# Altium project Atomizer_medical_V1_4.PrjPcb
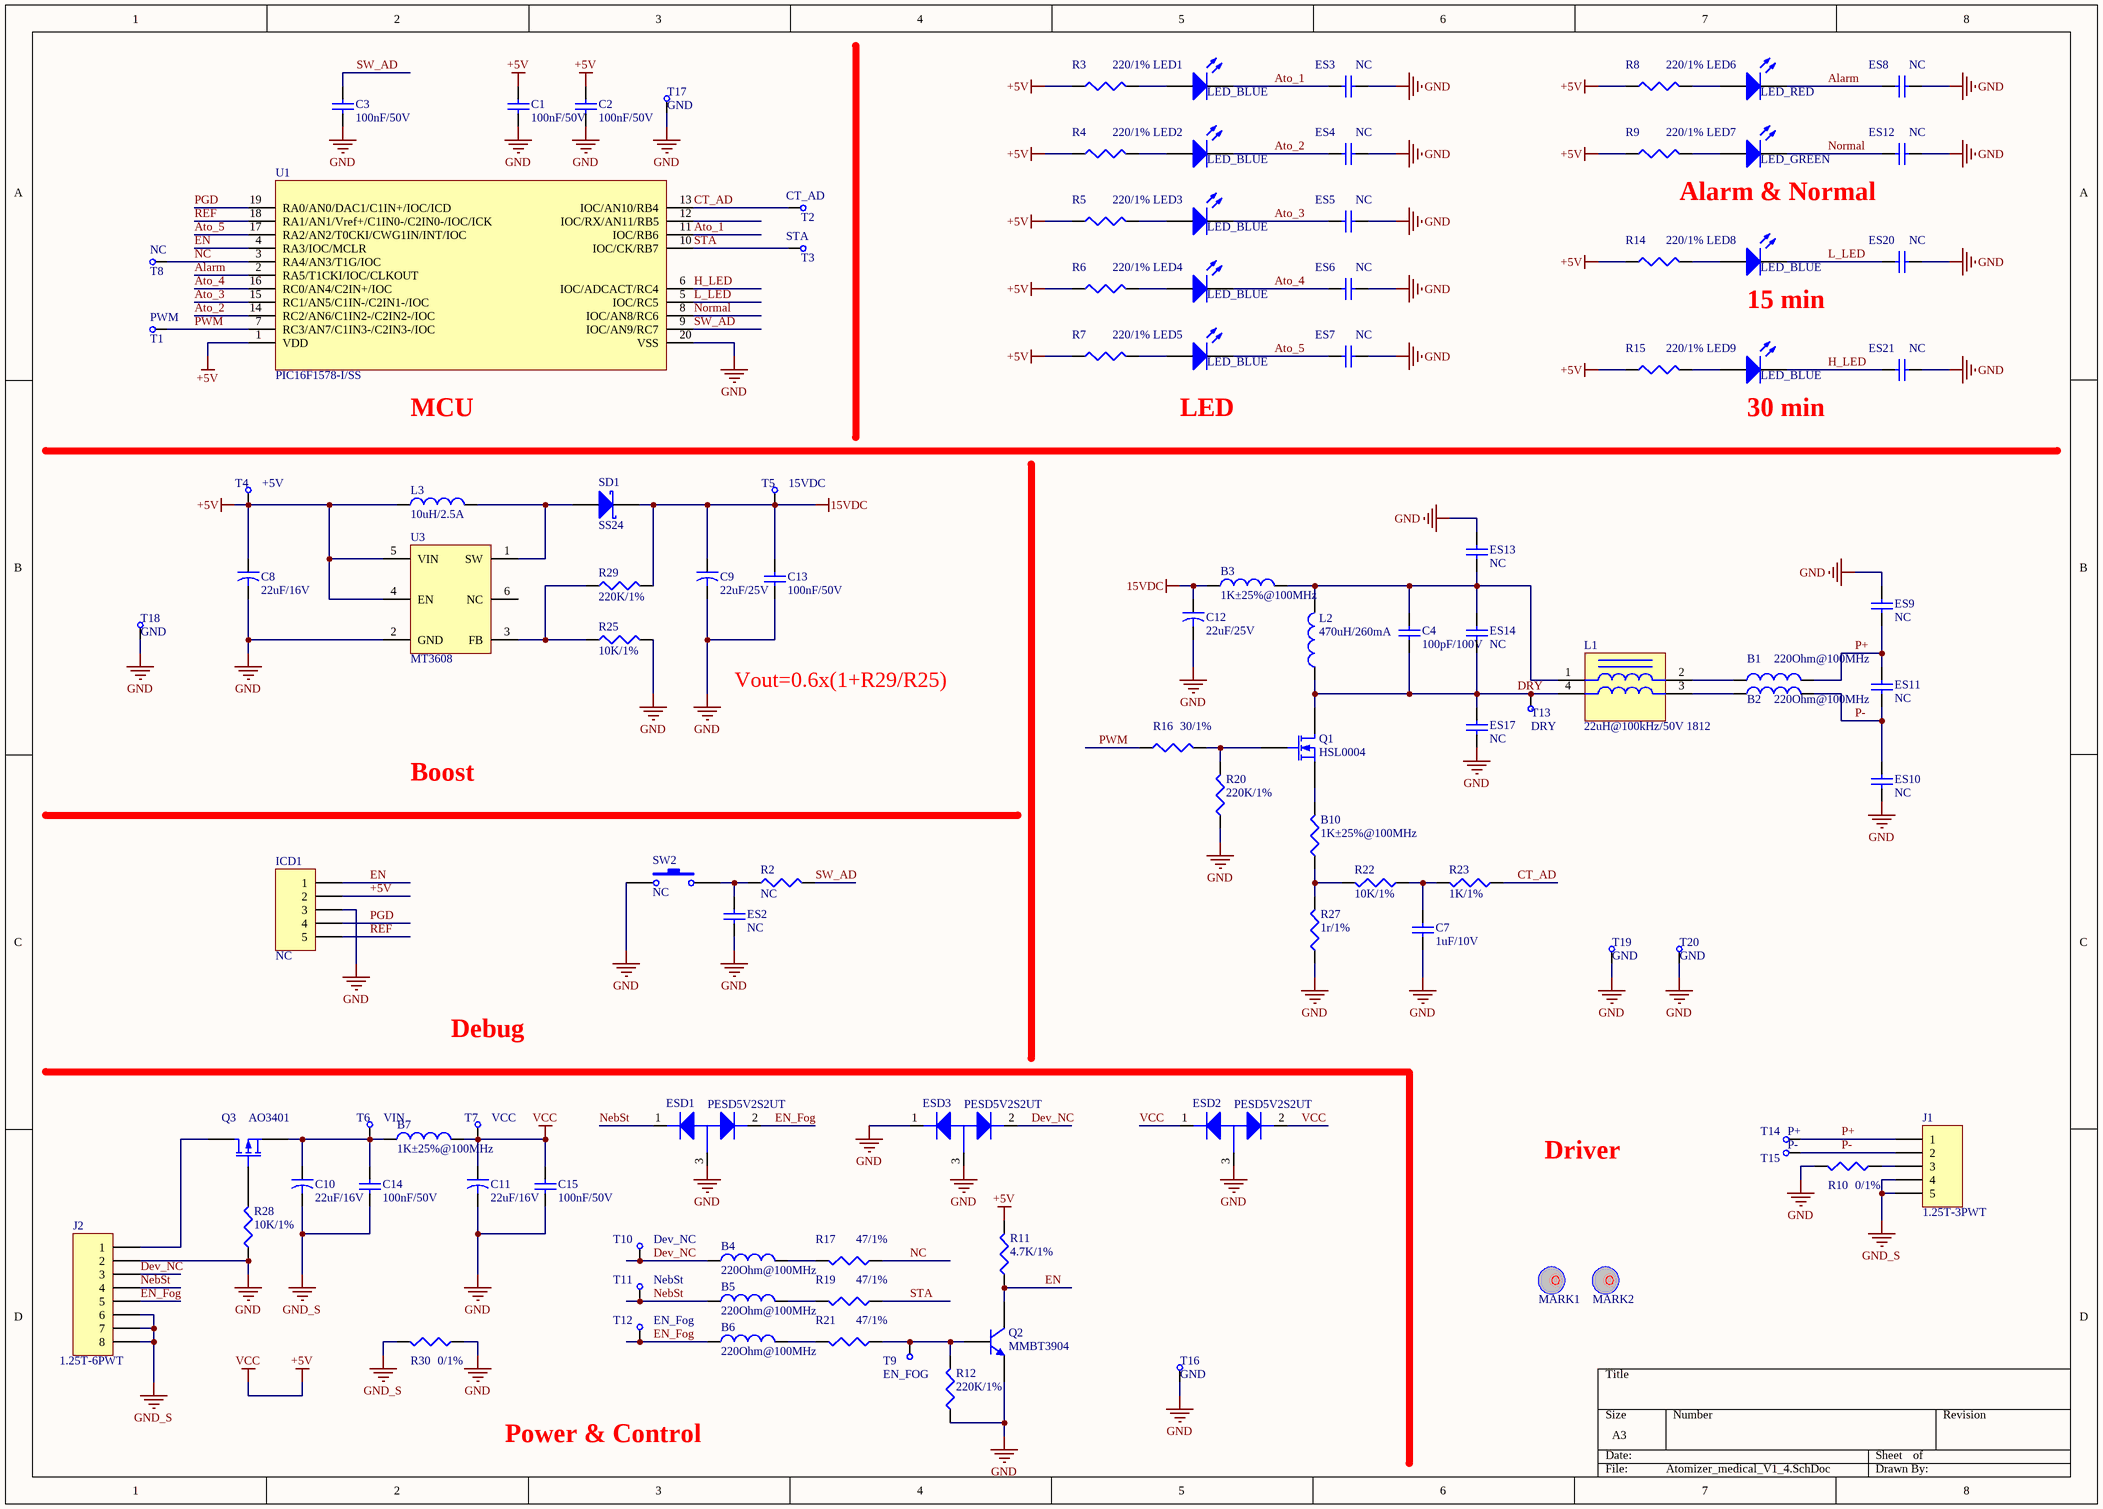
[diagram p0: Atomizer_medical_V1_4.SchDoc]
1 sheet, 109 parts. Net scope: global (net labels, ports and power ports of the same name join across sheets).
Board file: Atomizer_medical_V1_4.PCBDOC

## Sheet Atomizer_medical_V1_4.SchDoc
size A3

### Parts
B1  220Ohm@100MHz  [0402-B]
B2  220Ohm@100MHz  [0402-B]
B3  1K±25%@100MHz  [0805-B]
B4  220Ohm@100MHz  [0402-B]
B5  220Ohm@100MHz  [0402-B]
B6  220Ohm@100MHz  [0402-B]
B7  1K±25%@100MHz  [0805-B]
B10  1K±25%@100MHz  [0603]
C1  100nF/50V  [0402-C]
C2  100nF/50V  [0402-C]
C3  100nF/50V  [0402-C]
C4  100pF/100V  [0805-C]
C7  1uF/10V  [0402-C]
C8  22uF/16V  [0805-C]
C9  22uF/25V  [1206-C]
C10  22uF/16V  [0805-C]
C11  22uF/16V  [0805-C]
C12  22uF/25V  [1206-C]
C13  100nF/50V  [0402-C]
C14  100nF/50V  [0402-C]
C15  100nF/50V  [0402-C]
ES2  NC  [0402-C]
ES3  NC  [0402-C]
ES4  NC  [0402-C]
ES5  NC  [0402-C]
ES6  NC  [0402-C]
ES7  NC  [0402-C]
ES8  NC  [0402-C]
ES9  NC  [0402-C]
ES10  NC  [0402-C]
ES11  NC  [0402-C]
ES12  NC  [0402-C]
ES13  NC  [0402-C]
ES14  NC  [0402-C]
ES17  NC  [0402-C]
ES20  NC  [0402-C]
ES21  NC  [0402-C]
ESD1  PESD5V2S2UT  [SOT23]
ESD2  PESD5V2S2UT  [SOT23]
ESD3  PESD5V2S2UT  [SOT23]
ICD1  NC  [SIP1X5P1.25A-180-DIP]
J1  1.25T-3PWT  [WAFER_1.25MMX3P_180]
J2  1.25T-6PWT  [WAFER_1.25MMX6P_180]
L1  22uH@100kHz/50V 1812  [LINEFILTER]
L2  470uH/260mA  [SP0502]
L3  10uH/2.5A  [SP0502]
LED1  LED_BLUE  [LED0603]
LED2  LED_BLUE  [LED0603]
LED3  LED_BLUE  [LED0603]
LED4  LED_BLUE  [LED0603]
LED5  LED_BLUE  [LED0603]
LED6  LED_RED  [LED0603]
LED7  LED_GREEN  [LED0603]
LED8  LED_BLUE  [LED0603]
LED9  LED_BLUE  [LED0603]
MARK1  MARK_POINT  [MARK_POINT]  (value not drawn)
MARK2  MARK_POINT  [MARK_POINT]  (value not drawn)
Q1  HSL0004  [SOT223]
Q2  MMBT3904  [SOT23]
Q3  AO3401  [SOT23]
R2  NC  [0402]
R3  220/1%  [0402]
R4  220/1%  [0402]
R5  220/1%  [0402]
R6  220/1%  [0402]
R7  220/1%  [0402]
R8  220/1%  [0402]
R9  220/1%  [0402]
R10  0/1%  [0603]
R11  4.7K/1%  [0402]
R12  220K/1%  [0402]
R14  220/1%  [0402]
R15  220/1%  [0402]
R16  30/1%  [0402]
R17  47/1%  [0402]
R19  47/1%  [0402]
R20  220K/1%  [0402]
R21  47/1%  [0402]
R22  10K/1%  [0402]
R23  1K/1%  [0402]
R25  10K/1%  [0402]
R27  1r/1%  [0805]
R28  10K/1%  [0402]
R29  220K/1%  [0402]
R30  0/1%  [0603]
SD1  SS24  [SMA-403D]
SW2  NC  [HTS-52MB]
T1  PWM  [TP-SIP-1-Small1]
T2  CT_AD  [TP-SIP-1-Small1]
T3  STA  [TP-SIP-1-Small1]
T4  +5V  [TP-SIP-1-Small1]
T5  15VDC  [TP-SIP-1-Small1]
T6  VIN  [TP-SIP-1-Small1]
T7  VCC  [TP-SIP-1-Small1]
T8  NC  [TP-SIP-1-Small1]
T9  EN_FOG  [TP-SIP-1-Small1]
T10  Dev_NC  [TP-SIP-1-Small1]
T11  NebSt  [TP-SIP-1-Small1]
T12  EN_Fog  [TP-SIP-1-Small1]
T13  DRY  [TP-SIP-1-Small1]
T14  P+  [TP-SIP-1-Small1]
T15  P-  [TP-SIP-1-Small1]
T16  GND  [TP-SIP-1-Small1]
T17  GND  [TP-SIP-1-Small1]
T18  GND  [TP-SIP-1-Small1]
T19  GND  [TP-SIP-1-Small1]
T20  GND  [TP-SIP-1-Small1]
U1  PIC16F1578-I/SS  [SSOP-20]
U3  MT3608  [SOT95P280X110-6N]

### Nets
15VDC: B3.1 C9.1 C12.1 C13.1 R29.2 SD1.2(K) T5.1
+5V: B7.2 C1.2 C2.2 C8.1 C11.1 C15.1 ESD2.1(S) ESD2.2(S) ICD1.2 L3.1 R3.1 R4.1 R5.1 R6.1 R7.1 R8.1 R9.1 R11.2 R14.1 R15.1 T4.1 T7.1 U1.1(VDD) U3.4(EN) U3.5(VIN)  [also labelled VCC]
GND: C1.1 C2.1 C3.1 C7.2 C8.2 C9.2 C11.2 C12.2 C13.2 C15.2 ES2.2 ES3.1 ES4.1 ES5.1 ES6.1 ES7.1 ES8.1 ES9.1 ES10.2 ES12.1 ES13.1 ES17.2 ES20.1 ES21.1 ESD1.3(G) ESD2.3(G) ESD3.1(S) ESD3.3(G) ICD1.3 J2.2 Q2.2(E) R10.2 R12.1 R20.1 R25.2 R27.1 R28.1 R30.1 SW2.1 T16.1 T17.1 T18.1 T19.1 T20.1 U1.20(VSS) U3.2(GND)
GND_S: C10.2 C14.2 J1.4 J1.5 J2.6 J2.7 J2.8 R30.2
Alarm: ES8.2 LED6.2(K) U1.2(RA5/T1CKI/IOC/CLKOUT)
Ato_1: ES3.2 LED1.2(K) U1.11(IOC/RB6)
Ato_2: ES4.2 LED2.2(K) U1.14(RC2/AN6/C1IN2-/C2IN2-/IOC)
Ato_3: ES5.2 LED3.2(K) U1.15(RC1/AN5/C1IN-/C2IN1-/IOC)
Ato_4: ES6.2 LED4.2(K) U1.16(RC0/AN4/C2IN+/IOC)
Ato_5: ES7.2 LED5.2(K) U1.17(RA2/AN2/T0CKI/CWG1IN/INT/IOC)
CT_AD: R23.1 T2.1 U1.13(IOC/AN10/RB4)
Dev_NC: B4.1 ESD3.2(S) J2.3 T10.1
DRY: C4.2 ES14.2 ES17.1 L1.4 L2.1 Q1.2(D) T13.1
EN: ICD1.1 Q2.3(C) R11.1 U1.4(RA3/IOC/MCLR)
EN_Fog: B6.1 ESD1.2(S) J2.5 T12.1
H_LED: ES21.2 LED9.2(K) U1.6(IOC/ADCACT/RC4)
L_LED: ES20.2 LED8.2(K) U1.5(IOC/RC5)
NC: R17.1 T8.1 U1.3(RA4/AN3/T1G/IOC)
NebSt: B5.1 ESD1.1(S) J2.4 T11.1
Normal: ES12.2 LED7.2(K) U1.8(IOC/AN8/RC6)
P+: B1.2 ES9.2 ES11.1 J1.1 T14.1
P-: B2.2 ES10.1 ES11.2 J1.2 T15.1
PGD: ICD1.4 U1.19(RA0/AN0/DAC1/C1IN+/IOC/ICD)
PWM: R16.1 T1.1 U1.7(RC3/AN7/C1IN3-/C2IN3-/IOC)
REF: ICD1.5 U1.18(RA1/AN1/Vref+/C1IN0-/C2IN0-/IOC/ICK)
STA: R19.1 T3.1 U1.10(IOC/CK/RB7)
SW_AD: C3.2 R2.2 U1.9(IOC/AN9/RC7)
NetB1_1: B1.1 L1.2
NetB2_1: B2.1 L1.3
NetB3_2: B3.2 C4.1 ES13.2 ES14.1 L1.1 L2.2
NetB4_2: B4.2 R17.2
NetB5_2: B5.2 R19.2
NetB6_2: B6.2 R21.2
NetB7_1: B7.1 C10.1 C14.1 Q3.3(S) T6.1
NetB10_1: B10.1 R22.2 R27.2
NetB10_2: B10.2 Q1.3(S)
NetC7_1: C7.1 R22.1 R23.2
NetES2_1: ES2.1 R2.1 SW2.2
NetJ1_3: J1.3 R10.1
NetJ2_1: J2.1 Q3.2(D)
NetL3_2: L3.2 SD1.1(A) U3.1(SW)
NetLED1_1: LED1.1(A) R3.2
NetLED2_1: LED2.1(A) R4.2
NetLED3_1: LED3.1(A) R5.2
NetLED4_1: LED4.1(A) R6.2
NetLED5_1: LED5.1(A) R7.2
NetLED6_1: LED6.1(A) R8.2
NetLED7_1: LED7.1(A) R9.2
NetLED8_1: LED8.1(A) R14.2
NetLED9_1: LED9.1(A) R15.2
NetQ1_1: Q1.1(G) R16.2 R20.2
NetQ2_1: Q2.1(B) R12.2 R21.1 T9.1
NetQ3_1: Q3.1(G) R28.2
NetR25_1: R25.1 R29.1 U3.3(FB)

Not connected (* = marked no-connect by the designer): U1 12(IOC/RX/AN11/RB5); U3 6(NC)

### Notes on the sheet
- Alarm & Normal
- (near LED8) 15 min
- MCU
- (near LED5) LED
- (near LED9) 30 min
- Vout=0.6x(1+R29/R25)
- Boost
- Debug
- Driver
- Power & Control

### Library data of the parts
B1-B7 L2 L3 = Inductor: Code_IEC: 1005; Value: 10uH; Published: 8-Jun-2000; LatestRevisionDate: 29-May-2009; LatestRevisionNote: IPC-7351 Footprint Added.; PackageReference: 0402-A; Publisher: Altium Limited; PackageDescription: Chip Inductor; Code_JEITA: 0402
B10 R3-R9 R11 R12 R14-R17 R19-R23 R25 R27-R29 = Res3: Resistor; Value: 1K; Published: 8-Jun-2000; LatestRevisionDate: 29-May-2009; LatestRevisionNote: IPC-7351 Footprint Added.; PackageReference: J1-0603; Publisher: Altium Limited; PackageDescription: Chip Resistor
C1-C4 C7 C13-C15 ES2-ES14 ES17 ES20 ES21 = Cap Semi: Capacitor (Semiconductor SIM Model); Value: 100pF; Published: 8-Jun-2000; LatestRevisionDate: 29-May-2009; LatestRevisionNote: IPC-7351 Footprint Added.; PackageReference: C1206; Publisher: Altium Limited; PackageDescription: Chip Capacitor
C8-C12 = Cap2: Capacitor; Value: 100pF; Published: 23-Sep-2002; PackageReference: CAPR5-4X5; Publisher: Altium Limited; PackageDescription: Capacitor; 2 Leads
ESD1-ESD3 = ESD
ICD1 J1 = Header 5: Header, 5-Pin; LatestRevisionDate: 17-Jul-2002; LatestRevisionNote: Re-released for DXP Platform.; Publisher: Altium Limited
J2 = Header 8: Header, 8-Pin; LatestRevisionDate: 17-Jul-2002; LatestRevisionNote: Re-released for DXP Platform.; Publisher: Altium Limited
L1 = Inductor_common
LED1-LED9 = LED2: Typical RED, GREEN, YELLOW, AMBER GaAs LED; Published: 8-Jun-2000; LatestRevisionDate: 17-Jul-2002; LatestRevisionNote: Re-released for DXP Platform.; PackageVersion: Feb-2002; PackageReference: 3.2X1.6X1.1; Publisher: Altium Limited; PackageDescription: SM LED; 2 Flat Leads
Q1 = MOSFET-N: N-Channel MOSFET; Published: 8-Jun-2000; LatestRevisionDate: 17-Jul-2002; LatestRevisionNote: Re-released for DXP Platform.; PackageVersion: 1995/1996; PackageReference: E3; Publisher: Altium Limited; PackageDescription: TO, Flat Index; 3 In-Line, Axial Leads; Body Dia. 4.6mm; Lead Dia. 0.5 mm (max)
Q2 = NPN: NPN Bipolar Transistor; Published: 8-Jun-2000; LatestRevisionDate: 17-Jul-2002; LatestRevisionNote: Re-released for DXP Platform.; PackageReference: TO-226-AA; Publisher: Altium Limited; PackageDescription: TO, Flat Index; 3 In-Line, Axial Leads; Body Dia. 4.8mm; Leads 0.55 x 0.51 mm (max); Code_JEDEC: TO-226-AA
Q3 = MOSFET-P: P-Channel MOSFET; Published: 8-Jun-2000; LatestRevisionDate: 17-Jul-2002; LatestRevisionNote: Re-released for DXP Platform.; PackageVersion: 1995/1996; PackageReference: E3; Publisher: Altium Limited; PackageDescription: TO, Flat Index; 3 In-Line, Axial Leads; Body Dia. 4.6mm; Lead Dia. 0.5 mm (max)
R2 = Res3: Resistor; Value: 4.7K; Published: 8-Jun-2000; LatestRevisionDate: 29-May-2009; LatestRevisionNote: IPC-7351 Footprint Added.; PackageReference: J1-0603; Publisher: Altium Limited; PackageDescription: Chip Resistor
R10 R30 = Res3: Resistor; Value: 0; Published: 8-Jun-2000; LatestRevisionDate: 29-May-2009; LatestRevisionNote: IPC-7351 Footprint Added.; PackageReference: J1-0603; Publisher: Altium Limited; PackageDescription: Chip Resistor
SD1 = D Schottky: Schottky Diode; Published: 8-Jun-2000; LatestRevisionDate: 17-Jul-2002; LatestRevisionNote: Re-released for DXP Platform.; PackageReference: SMB; Publisher: Altium Limited; PackageDescription: DO-214-AA/SMB; 2 C-Bend Leads; Body 5.3 x 3.6 mm, inc. leads (LxW); Code_JEDEC: DO-214-AA
SW2 = SW-PB: Switch; Published: 24-Mar-1999; LatestRevisionDate: 17-Jul-2002; LatestRevisionNote: Re-released for DXP Platform.; PackageReference: SPST-2; Publisher: Altium Limited; PackageDescription: Switch; 2 Leads
T1-T20 = TP-SIP-1-Small
U1 = PIC16F1578-I/SS: PIC16  SSOP-20
U3 = MT3608: DC-DC-BOOST